# Altium schematic sheet 3_ESP8266_Core.SchDoc: ESP8266_Core
size A4; ApprovedBy: Alcatraz; CheckedBy: Alcatraz; Author: Alcatraz; CompanyName: DHNLAB; DrawnBy: Alcatraz; Engineer: Alcatraz; Organization: DHNLAB PVT LTD; Address1: DHANBAD; Address2: JHARKHAND; Address3: INDIA; Address4: ASIA; DocumentNumber: 3; Revision: 1.0; SheetNumber: 3; SheetTotal: 10; ProjectTitle: ESP8266-Deskop_Power
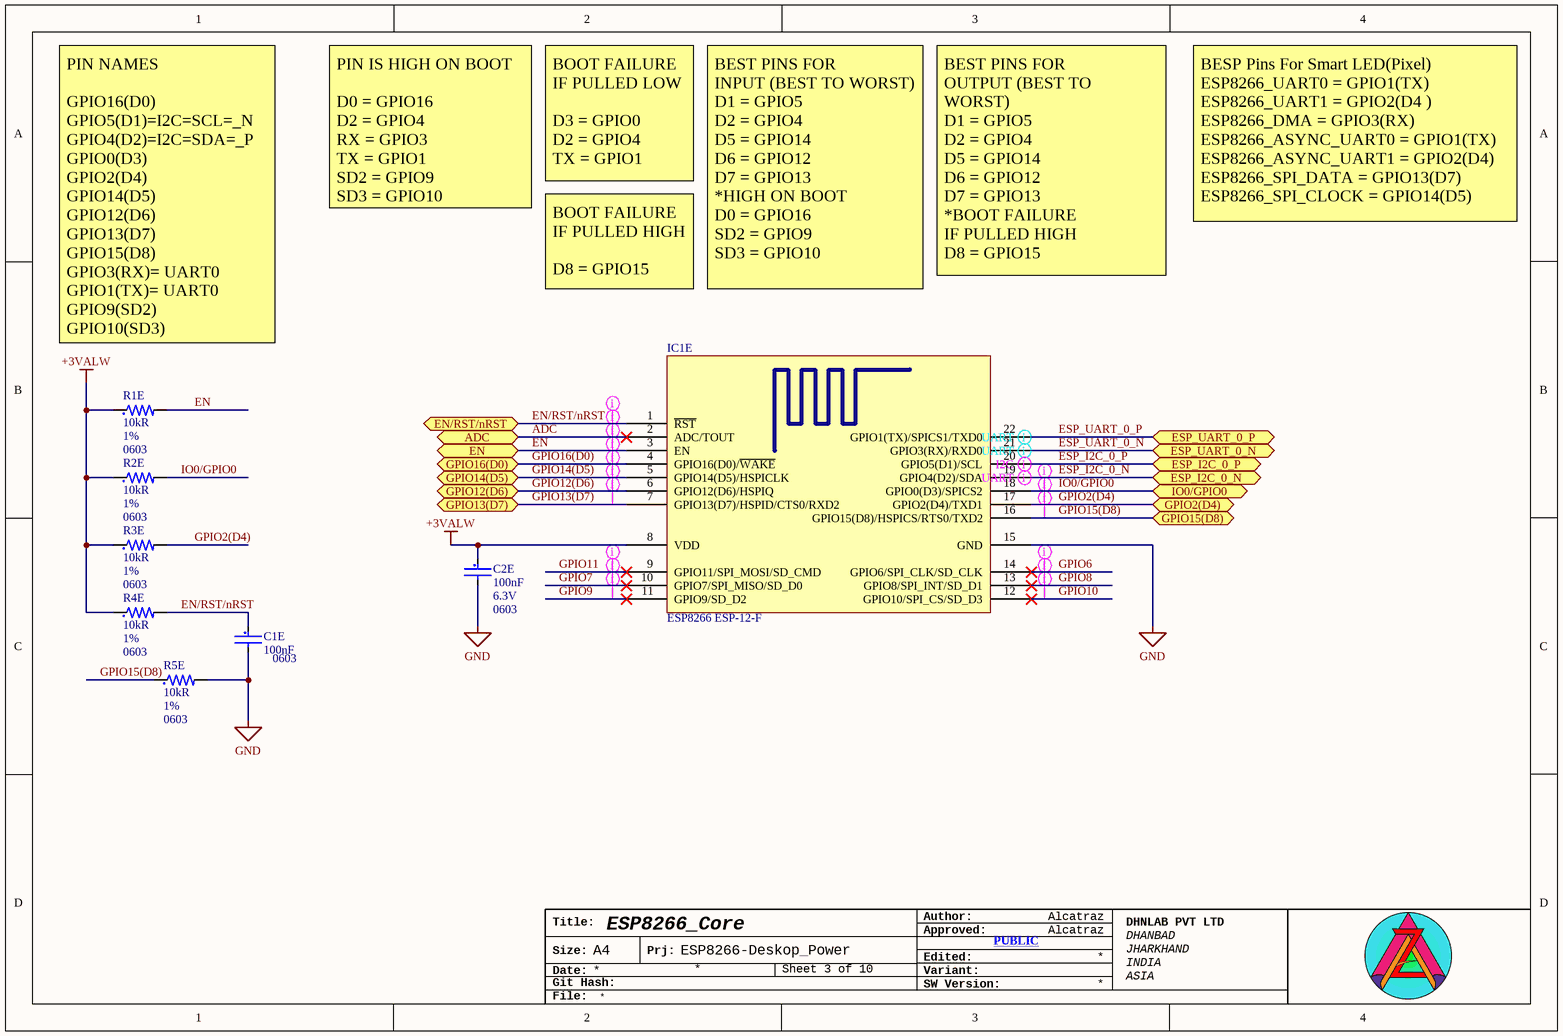
[diagram p0: 3_ESP8266_Core.SchDoc]

## Parts
C1E  value 100nF  Package: 0603  [C0603-IPC_C_No_Silk]  (hidden comment: KGM15AR70J104KM)
C2E  value 100nF  Voltage: 6.3V  Package: 0603  [C0603-IPC_C_No_Silk]  (hidden comment: KGM15AR70J104KM)
IC1E  ESP8266 ESP-12-F  [ESP8266 ESP-12-Large]
R1E  value 10kR  Tolerance: 1%  Case/Package: 0603  [R0603-MFG]  (hidden comment: RC0603FR-0710KL)
R2E  value 10kR  Tolerance: 1%  Case/Package: 0603  [R0603-MFG]  (hidden comment: RC0603FR-0710KL)
R3E  value 10kR  Tolerance: 1%  Case/Package: 0603  [R0603-MFG]  (hidden comment: RC0603FR-0710KL)
R4E  value 10kR  Tolerance: 1%  Case/Package: 0603  [R0603-MFG]  (hidden comment: RC0603FR-0710KL)
R5E  value 10kR  Tolerance: 1%  Case/Package: 0603  [R0603-MFG]  (hidden comment: RC0603FR-0710KL)

## Ports
ADC (bidir, see 3_ESP8266_Core[4B]), EN (bidir, see 3_ESP8266_Core[4B]), EN/RST/nRST (bidir), ESP_I2C_0_N (bidir, see 4_ESP32-Core[1C], 9_I2C & I2S[2A], 9_I2C & I2S[2B]), ESP_I2C_0_P (bidir, see 4_ESP32-Core[1C], 9_I2C & I2S[2A], 9_I2C & I2S[2B]), ESP_UART_0_N (bidir, see 4_ESP32-Core[3B]), ESP_UART_0_P (bidir, see 4_ESP32-Core[3B]), GPIO2(D4) (bidir, see 3_ESP8266_Core[2B]), GPIO12(D6) (bidir, see 3_ESP8266_Core[4B]), GPIO13(D7) (bidir, see 3_ESP8266_Core[4B]), GPIO14(D5) (bidir, see 3_ESP8266_Core[4B]), GPIO15(D8) (bidir, see 3_ESP8266_Core[2B]), GPIO16(D0) (bidir, see 3_ESP8266_Core[4B]), IO0/GPIO0 (bidir)

## Nets
+3VALW: C2E.1 IC1E.8(VDD) R1E.1 R2E.1 R3E.1 R4E.1
GND: C1E.2 C2E.2 IC1E.15(GND) R5E.2
ADC: IC1E.2(ADC/TOUT) ; port ADC
EN: IC1E.3(EN) R1E.2 ; port EN
EN/RST/nRST: C1E.1 IC1E.1(~{RST}) R4E.2 ; port EN/RST/nRST
ESP_I2C_0_N: IC1E.19(GPIO4(D2)/SDA) ; port ESP_I2C_0_N
ESP_I2C_0_P: IC1E.20(GPIO5(D1)/SCL) ; port ESP_I2C_0_P
ESP_UART_0_N: IC1E.21(GPIO3(RX)/RXD0) ; port ESP_UART_0_N
ESP_UART_0_P: IC1E.22(GPIO1(TX)/SPICS1/TXD0) ; port ESP_UART_0_P
GPIO2(D4): IC1E.17(GPIO2(D4)/TXD1) R3E.2 ; port GPIO2(D4)
GPIO6: IC1E.14(GPIO6/SPI_CLK/SD_CLK)
GPIO7: IC1E.10(GPIO7/SPI_MISO/SD_D0)
GPIO8: IC1E.13(GPIO8/SPI_INT/SD_D1)
GPIO9: IC1E.11(GPIO9/SD_D2)
GPIO10: IC1E.12(GPIO10/SPI_CS/SD_D3)
GPIO11: IC1E.9(GPIO11/SPI_MOSI/SD_CMD)
GPIO12(D6): IC1E.6(GPIO12(D6)/HSPIQ) ; port GPIO12(D6)
GPIO13(D7): IC1E.7(GPIO13(D7)/HSPID/CTS0/RXD2) ; port GPIO13(D7)
GPIO14(D5): IC1E.5(GPIO14(D5)/HSPICLK) ; port GPIO14(D5)
GPIO15(D8): IC1E.16(GPIO15(D8)/HSPICS/RTS0/TXD2) R5E.1 ; port GPIO15(D8)
GPIO16(D0): IC1E.4(GPIO16(D0)/~{WAKE}) ; port GPIO16(D0)
IO0/GPIO0: IC1E.18(GPIO0(D3)/SPICS2) R2E.2 ; port IO0/GPIO0

## Layout directives
net class Digital_Signal_Low_Speed; net class Signal_75_ohm: ADC, EN, EN/RST/nRST, GPIO2(D4), GPIO6, GPIO7, GPIO8, GPIO9, GPIO10, GPIO11, GPIO12(D6), GPIO13(D7), GPIO14(D5), GPIO15(D8), GPIO16(D0), IO0/GPIO0
differential pair; differential pair class UART: ESP_UART_0_N, ESP_UART_0_P
differential pair; differential pair class I2C: ESP_I2C_0_N, ESP_I2C_0_P

## Notes on the sheet
- BOOT FAILURE
  IF PULLED LOW
  D3 = GPIO0
  D2 = GPIO4
  TX = GPIO1
- PIN IS HIGH ON BOOT
  D0 = GPIO16
  D2 = GPIO4
  RX = GPIO3
  TX = GPIO1
  SD2 = GPIO9
  SD3 = GPIO10
- BESP Pins For Smart LED(Pixel)
  ESP8266_UART0 = GPIO1(TX)
  ESP8266_UART1 = GPIO2(D4 )
  ESP8266_DMA = GPIO3(RX)
  ESP8266_ASYNC_UART0 = GPIO1(TX)
  ESP8266_ASYNC_UART1 = GPIO2(D4)
  ESP8266_SPI_DATA = GPIO13(D7)
  ESP8266_SPI_CLOCK = GPIO14(D5)
- BOOT FAILURE
  IF PULLED HIGH
  D8 = GPIO15
- BEST PINS FOR
  INPUT (BEST TO WORST)
  D1 = GPIO5
  D2 = GPIO4
  D5 = GPIO14
  D6 = GPIO12
  D7 = GPIO13
  *HIGH ON BOOT
  D0 = GPIO16
  SD2 = GPIO9
  SD3 = GPIO10
- BEST PINS FOR
  OUTPUT (BEST TO WORST)
  D1 = GPIO5
  D2 = GPIO4
  D5 = GPIO14
  D6 = GPIO12
  D7 = GPIO13
  *BOOT FAILURE
  IF PULLED HIGH
  D8 = GPIO15
- PIN NAMES
  GPIO16(D0)
  GPIO5(D1)=I2C=SCL=_N
  GPIO4(D2)=I2C=SDA=_P
  GPIO0(D3)
  GPIO2(D4)
  GPIO14(D5)
  GPIO12(D6)
  GPIO13(D7)
  GPIO15(D8)
  GPIO3(RX)= UART0
  GPIO1(TX)= UART0
  GPIO9(SD2)
  GPIO10(SD3)
- Title:
- Author:
- Approved:
- Size:
- Date:
- Git Hash:
- A4
- Prj:
- SW Version:
- Variant:
- Edited:
- PUBLIC
- File:

## Library data of the parts
C1E C2E = 100nF_6.3V: Cap Cer 0.1UF 6.3V X7R 0603; Manufacturer: KYOCERA AVX; Tol: 10%; Supplier 1: Digikey; Supplier Part Number 1: 478-KGM15AR70J104KMCT-ND; Manufacturer Part Number: KGM15AR70J104KM; Category: Ceramic Capacitors; Stock 1: 117167; Pricing 1: 1=0.1, 10=0.032, 50=0.0186, 100=0.0144, 500=0.01082, 1000=0.0085, 2500=0.00772, 5000=0.00711 (USD)
  C1E: Voltage: 6.3V
R1E R2E R3E R4E R5E = 10K: SMD Chip Resistor, 10 kOhm, ± 1%, 100 mW, 0603 [1608 Metric], Thick Film, General Purpose; Manufacturer: Yageo; Power Rating: 100mW; Temperature Coefficient: 100ppm/°C; Voltage Rating (DC): 50V; Voltage Rating: 75V; Supplier 1: Future Electronics; Manufacturer Part Number: RC0603FR-0710KL; RoHS: Yes; Category: Chip SMD Resistors; Stock 1: 44660000; Pricing 1: 5000=0.0015, 50000=0.0014, 150000=0.0014, 375000=0.0013, 1000000=0.0012 (USD); Case Code (Imperial): 0603; Case Code (Metric): 1608; Min Operating Temperature: -55°C; Max Operating Temperature: 155°C; Packaging: Tape and Reel; Series: RC; Termination: SMD/SMT; Construction: Rectangular; Length: 1.6mm; Width: 0.8mm; Height: 0.45mm; Depth: 0.8mm; RoHS Compliant: Yes; Military Standard: Not; Lead Free: 5697LeadFree; Supplier Part Number 1: 4023214; Pins: 2; Weight: 7.1E-05oz; Resistance Tolerance: 1%; Resistor Type: Thick Film; Max Power Dissipation: 100mW; Features: Moisture Resistant; Number of Terminations: 2; Lead Pitch: 0.3mm; Reach SVHC Compliant: No